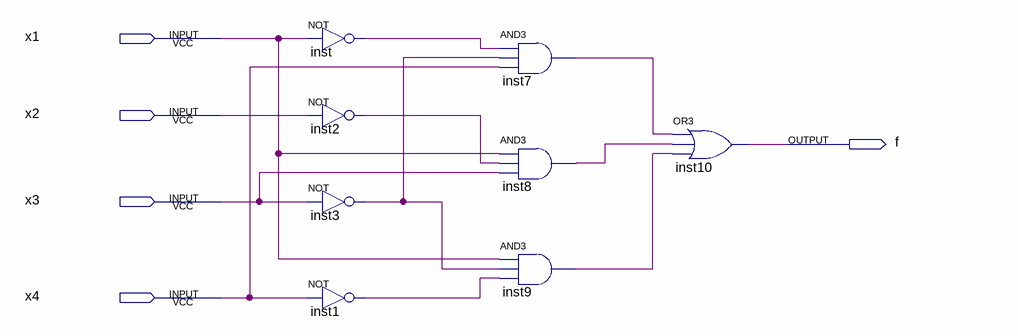
[diagram p0: schematic sheet]
// Quartus schematic Lab2BlockDiagram.bdf as structural Verilog: 8 symbols, 5 pins
module Lab2BlockDiagram (
  input  x1,
  input  x2,
  input  x3,
  input  x4,
  output f
);

  wire inst1_out, inst2_out, inst3_out, inst7_out, inst8_out, inst9_out, inst_out;

  not inst (inst_out, x1);
  not inst2 (inst2_out, x2);
  not inst3 (inst3_out, x3);
  not inst1 (inst1_out, x4);
  and inst7 (inst7_out, inst_out, inst3_out, x4);
  and inst8 (inst8_out, x1, inst2_out, x3);
  and inst9 (inst9_out, x1, inst3_out, inst1_out);
  or inst10 (f, inst7_out, inst8_out, inst9_out);
endmodule
